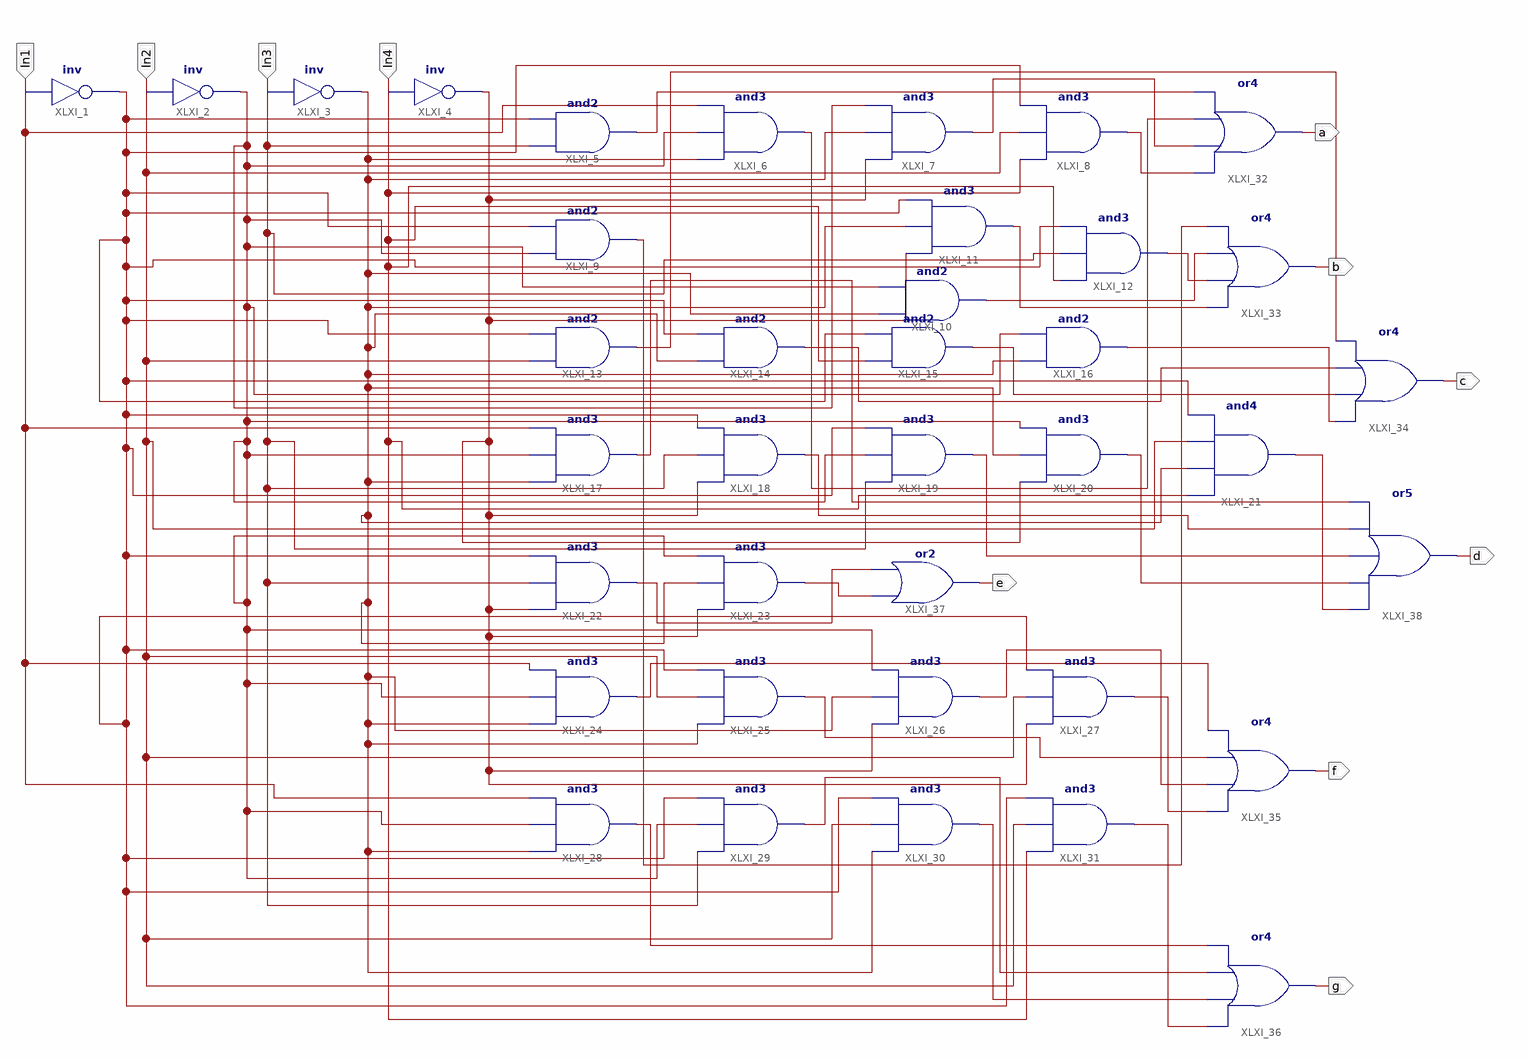
[diagram p0: schematic sheet 1]
// Xilinx ISE schematic BCD_DECODER_FIXNAJA.sch (spartan6) as structural Verilog: 38 symbols, 11 ports
module BCD_DECODER_FIXNAJA (
  input  In1,
  input  In2,
  input  In3,
  input  In4,
  output a,
  output b,
  output c,
  output d,
  output e,
  output f,
  output g
);

  wire XLXN_15, XLXN_19, XLXN_21, XLXN_23, XLXN_25, XLXN_26, XLXN_27, XLXN_28, XLXN_29, XLXN_32, XLXN_33,
       XLXN_36, XLXN_37, XLXN_38, XLXN_39, XLXN_40, XLXN_41, XLXN_42, XLXN_43, XLXN_44, XLXN_45, XLXN_46,
       XLXN_48, XLXN_49, XLXN_50, XLXN_52, XLXN_53, XLXN_54, XLXN_55, XLXN_56, XLXN_57;

  not XLXI_1 (XLXN_15, In1);
  not XLXI_2 (XLXN_19, In2);
  not XLXI_3 (XLXN_23, In3);
  not XLXI_4 (XLXN_21, In4);
  and XLXI_5 (XLXN_25, In3, XLXN_15);
  and XLXI_6 (XLXN_26, XLXN_23, XLXN_19, In1);
  and XLXI_7 (XLXN_27, XLXN_21, XLXN_23, XLXN_19);
  and XLXI_8 (XLXN_28, In4, In2, XLXN_15);
  and XLXI_9 (XLXN_29, XLXN_19, XLXN_15);
  and XLXI_10 (XLXN_32, XLXN_23, XLXN_19);
  and XLXI_11 (XLXN_33, XLXN_21, XLXN_23, XLXN_15);
  and XLXI_12 (XLXN_36, In4, In3, XLXN_15);
  and XLXI_13 (XLXN_37, In2, XLXN_15);
  and XLXI_14 (XLXN_38, XLXN_23, XLXN_15);
  and XLXI_15 (XLXN_39, In4, XLXN_15);
  and XLXI_16 (XLXN_40, XLXN_23, XLXN_19);
  and XLXI_17 (XLXN_41, XLXN_23, XLXN_19, In1);
  and XLXI_18 (XLXN_42, XLXN_21, In3, XLXN_15);
  and XLXI_19 (XLXN_43, In3, XLXN_19, XLXN_15);
  and XLXI_20 (XLXN_44, XLXN_21, XLXN_23, XLXN_19);
  and XLXI_21 (XLXN_45, In4, XLXN_23, In2, XLXN_15);
  and XLXI_22 (XLXN_46, XLXN_21, In3, XLXN_15);
  and XLXI_23 (XLXN_48, XLXN_21, XLXN_23, XLXN_19);
  and XLXI_24 (XLXN_49, XLXN_23, XLXN_19, In1);
  and XLXI_25 (XLXN_50, XLXN_23, In2, XLXN_15);
  and XLXI_26 (XLXN_52, XLXN_21, XLXN_23, XLXN_19);
  and XLXI_27 (XLXN_53, XLXN_21, In2, XLXN_15);
  and XLXI_28 (XLXN_54, XLXN_23, XLXN_19, In1);
  and XLXI_29 (XLXN_55, In3, XLXN_19, XLXN_15);
  and XLXI_30 (XLXN_56, XLXN_23, In2, XLXN_15);
  and XLXI_31 (XLXN_57, In4, In2, XLXN_15);
  or XLXI_32 (a, XLXN_28, XLXN_27, XLXN_26, XLXN_25);
  or XLXI_33 (b, XLXN_33, XLXN_36, XLXN_32, XLXN_29);
  or XLXI_34 (c, XLXN_40, XLXN_39, XLXN_38, XLXN_37);
  or XLXI_35 (f, XLXN_53, XLXN_52, XLXN_50, XLXN_49);
  or XLXI_36 (g, XLXN_57, XLXN_56, XLXN_55, XLXN_54);
  or XLXI_37 (e, XLXN_48, XLXN_46);
  or XLXI_38 (d, XLXN_45, XLXN_44, XLXN_43, XLXN_42, XLXN_41);
endmodule
